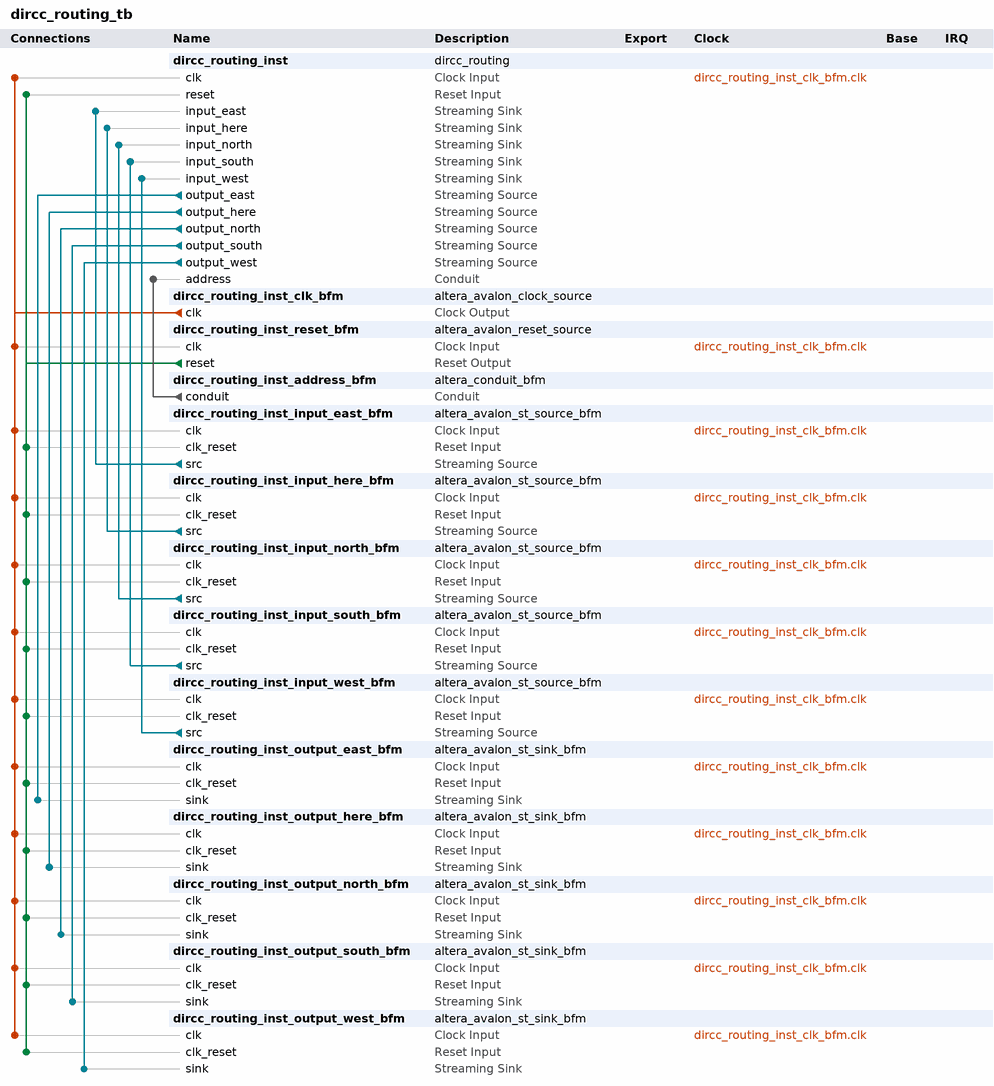
[diagram p0: system contents]
# Platform Designer (Qsys) system dircc_routing_tb, Cyclone V 5CSEMA5F31C6
# Parameters at their usual value, and those the tool derives, are not listed.
package require -exact qsys 16.1
create_system dircc_routing_tb
set_project_property DEVICE_FAMILY {Cyclone V}
set_project_property DEVICE 5CSEMA5F31C6

add_instance dircc_routing_inst dircc_routing 1.0

add_instance dircc_routing_inst_clk_bfm altera_avalon_clock_source 16.1

add_instance dircc_routing_inst_reset_bfm altera_avalon_reset_source 16.1
set_instance_parameter_value dircc_routing_inst_reset_bfm ASSERT_HIGH_RESET 0
set_instance_parameter_value dircc_routing_inst_reset_bfm INITIAL_RESET_CYCLES 50

add_instance dircc_routing_inst_address_bfm altera_conduit_bfm 16.1
set_instance_parameter_value dircc_routing_inst_address_bfm CLOCKED_SIGNAL false
set_instance_parameter_value dircc_routing_inst_address_bfm ENABLE_RESET false
set_instance_parameter_value dircc_routing_inst_address_bfm SIGNAL_DIRECTIONS output
set_instance_parameter_value dircc_routing_inst_address_bfm SIGNAL_ROLES address
set_instance_parameter_value dircc_routing_inst_address_bfm SIGNAL_WIDTHS 32

add_instance dircc_routing_inst_input_east_bfm altera_avalon_st_source_bfm 16.1
set_instance_parameter_value dircc_routing_inst_input_east_bfm ST_CHANNEL_W 1
set_instance_parameter_value dircc_routing_inst_input_east_bfm ST_ERROR_W 1
set_instance_parameter_value dircc_routing_inst_input_east_bfm ST_MAX_CHANNELS 0
set_instance_parameter_value dircc_routing_inst_input_east_bfm ST_NUMSYMBOLS 4
set_instance_parameter_value dircc_routing_inst_input_east_bfm ST_SYMBOL_W 8
set_instance_parameter_value dircc_routing_inst_input_east_bfm USE_CHANNEL 0
set_instance_parameter_value dircc_routing_inst_input_east_bfm USE_EMPTY 1
set_instance_parameter_value dircc_routing_inst_input_east_bfm USE_ERROR 0
set_instance_parameter_value dircc_routing_inst_input_east_bfm USE_PACKET 1
set_instance_parameter_value dircc_routing_inst_input_east_bfm USE_READY 1
set_instance_parameter_value dircc_routing_inst_input_east_bfm USE_VALID 1

add_instance dircc_routing_inst_input_here_bfm altera_avalon_st_source_bfm 16.1
set_instance_parameter_value dircc_routing_inst_input_here_bfm ST_CHANNEL_W 1
set_instance_parameter_value dircc_routing_inst_input_here_bfm ST_ERROR_W 1
set_instance_parameter_value dircc_routing_inst_input_here_bfm ST_MAX_CHANNELS 0
set_instance_parameter_value dircc_routing_inst_input_here_bfm ST_NUMSYMBOLS 4
set_instance_parameter_value dircc_routing_inst_input_here_bfm ST_SYMBOL_W 8
set_instance_parameter_value dircc_routing_inst_input_here_bfm USE_CHANNEL 0
set_instance_parameter_value dircc_routing_inst_input_here_bfm USE_EMPTY 1
set_instance_parameter_value dircc_routing_inst_input_here_bfm USE_ERROR 0
set_instance_parameter_value dircc_routing_inst_input_here_bfm USE_PACKET 1
set_instance_parameter_value dircc_routing_inst_input_here_bfm USE_READY 1
set_instance_parameter_value dircc_routing_inst_input_here_bfm USE_VALID 1
set_instance_parameter_value dircc_routing_inst_input_here_bfm VHDL_ID 1

add_instance dircc_routing_inst_input_north_bfm altera_avalon_st_source_bfm 16.1
set_instance_parameter_value dircc_routing_inst_input_north_bfm ST_CHANNEL_W 1
set_instance_parameter_value dircc_routing_inst_input_north_bfm ST_ERROR_W 1
set_instance_parameter_value dircc_routing_inst_input_north_bfm ST_MAX_CHANNELS 0
set_instance_parameter_value dircc_routing_inst_input_north_bfm ST_NUMSYMBOLS 4
set_instance_parameter_value dircc_routing_inst_input_north_bfm ST_SYMBOL_W 8
set_instance_parameter_value dircc_routing_inst_input_north_bfm USE_CHANNEL 0
set_instance_parameter_value dircc_routing_inst_input_north_bfm USE_EMPTY 1
set_instance_parameter_value dircc_routing_inst_input_north_bfm USE_ERROR 0
set_instance_parameter_value dircc_routing_inst_input_north_bfm USE_PACKET 1
set_instance_parameter_value dircc_routing_inst_input_north_bfm USE_READY 1
set_instance_parameter_value dircc_routing_inst_input_north_bfm USE_VALID 1
set_instance_parameter_value dircc_routing_inst_input_north_bfm VHDL_ID 2

add_instance dircc_routing_inst_input_south_bfm altera_avalon_st_source_bfm 16.1
set_instance_parameter_value dircc_routing_inst_input_south_bfm ST_CHANNEL_W 1
set_instance_parameter_value dircc_routing_inst_input_south_bfm ST_ERROR_W 1
set_instance_parameter_value dircc_routing_inst_input_south_bfm ST_MAX_CHANNELS 0
set_instance_parameter_value dircc_routing_inst_input_south_bfm ST_NUMSYMBOLS 4
set_instance_parameter_value dircc_routing_inst_input_south_bfm ST_SYMBOL_W 8
set_instance_parameter_value dircc_routing_inst_input_south_bfm USE_CHANNEL 0
set_instance_parameter_value dircc_routing_inst_input_south_bfm USE_EMPTY 1
set_instance_parameter_value dircc_routing_inst_input_south_bfm USE_ERROR 0
set_instance_parameter_value dircc_routing_inst_input_south_bfm USE_PACKET 1
set_instance_parameter_value dircc_routing_inst_input_south_bfm USE_READY 1
set_instance_parameter_value dircc_routing_inst_input_south_bfm USE_VALID 1
set_instance_parameter_value dircc_routing_inst_input_south_bfm VHDL_ID 3

add_instance dircc_routing_inst_input_west_bfm altera_avalon_st_source_bfm 16.1
set_instance_parameter_value dircc_routing_inst_input_west_bfm ST_CHANNEL_W 1
set_instance_parameter_value dircc_routing_inst_input_west_bfm ST_ERROR_W 1
set_instance_parameter_value dircc_routing_inst_input_west_bfm ST_MAX_CHANNELS 0
set_instance_parameter_value dircc_routing_inst_input_west_bfm ST_NUMSYMBOLS 4
set_instance_parameter_value dircc_routing_inst_input_west_bfm ST_SYMBOL_W 8
set_instance_parameter_value dircc_routing_inst_input_west_bfm USE_CHANNEL 0
set_instance_parameter_value dircc_routing_inst_input_west_bfm USE_EMPTY 1
set_instance_parameter_value dircc_routing_inst_input_west_bfm USE_ERROR 0
set_instance_parameter_value dircc_routing_inst_input_west_bfm USE_PACKET 1
set_instance_parameter_value dircc_routing_inst_input_west_bfm USE_READY 1
set_instance_parameter_value dircc_routing_inst_input_west_bfm USE_VALID 1
set_instance_parameter_value dircc_routing_inst_input_west_bfm VHDL_ID 4

add_instance dircc_routing_inst_output_east_bfm altera_avalon_st_sink_bfm 16.1
set_instance_parameter_value dircc_routing_inst_output_east_bfm ST_CHANNEL_W 1
set_instance_parameter_value dircc_routing_inst_output_east_bfm ST_ERROR_W 1
set_instance_parameter_value dircc_routing_inst_output_east_bfm ST_MAX_CHANNELS 0
set_instance_parameter_value dircc_routing_inst_output_east_bfm ST_NUMSYMBOLS 4
set_instance_parameter_value dircc_routing_inst_output_east_bfm ST_READY_LATENCY 0
set_instance_parameter_value dircc_routing_inst_output_east_bfm ST_SYMBOL_W 8
set_instance_parameter_value dircc_routing_inst_output_east_bfm USE_CHANNEL 0
set_instance_parameter_value dircc_routing_inst_output_east_bfm USE_EMPTY 1
set_instance_parameter_value dircc_routing_inst_output_east_bfm USE_ERROR 0
set_instance_parameter_value dircc_routing_inst_output_east_bfm USE_PACKET 1
set_instance_parameter_value dircc_routing_inst_output_east_bfm USE_READY 1
set_instance_parameter_value dircc_routing_inst_output_east_bfm USE_VALID 1
set_instance_parameter_value dircc_routing_inst_output_east_bfm VHDL_ID 0

add_instance dircc_routing_inst_output_here_bfm altera_avalon_st_sink_bfm 16.1
set_instance_parameter_value dircc_routing_inst_output_here_bfm ST_CHANNEL_W 1
set_instance_parameter_value dircc_routing_inst_output_here_bfm ST_ERROR_W 1
set_instance_parameter_value dircc_routing_inst_output_here_bfm ST_MAX_CHANNELS 0
set_instance_parameter_value dircc_routing_inst_output_here_bfm ST_NUMSYMBOLS 4
set_instance_parameter_value dircc_routing_inst_output_here_bfm ST_READY_LATENCY 0
set_instance_parameter_value dircc_routing_inst_output_here_bfm ST_SYMBOL_W 8
set_instance_parameter_value dircc_routing_inst_output_here_bfm USE_CHANNEL 0
set_instance_parameter_value dircc_routing_inst_output_here_bfm USE_EMPTY 1
set_instance_parameter_value dircc_routing_inst_output_here_bfm USE_ERROR 0
set_instance_parameter_value dircc_routing_inst_output_here_bfm USE_PACKET 1
set_instance_parameter_value dircc_routing_inst_output_here_bfm USE_READY 1
set_instance_parameter_value dircc_routing_inst_output_here_bfm USE_VALID 1
set_instance_parameter_value dircc_routing_inst_output_here_bfm VHDL_ID 1

add_instance dircc_routing_inst_output_north_bfm altera_avalon_st_sink_bfm 16.1
set_instance_parameter_value dircc_routing_inst_output_north_bfm ST_CHANNEL_W 1
set_instance_parameter_value dircc_routing_inst_output_north_bfm ST_ERROR_W 1
set_instance_parameter_value dircc_routing_inst_output_north_bfm ST_MAX_CHANNELS 0
set_instance_parameter_value dircc_routing_inst_output_north_bfm ST_NUMSYMBOLS 4
set_instance_parameter_value dircc_routing_inst_output_north_bfm ST_READY_LATENCY 0
set_instance_parameter_value dircc_routing_inst_output_north_bfm ST_SYMBOL_W 8
set_instance_parameter_value dircc_routing_inst_output_north_bfm USE_CHANNEL 0
set_instance_parameter_value dircc_routing_inst_output_north_bfm USE_EMPTY 1
set_instance_parameter_value dircc_routing_inst_output_north_bfm USE_ERROR 0
set_instance_parameter_value dircc_routing_inst_output_north_bfm USE_PACKET 1
set_instance_parameter_value dircc_routing_inst_output_north_bfm USE_READY 1
set_instance_parameter_value dircc_routing_inst_output_north_bfm USE_VALID 1
set_instance_parameter_value dircc_routing_inst_output_north_bfm VHDL_ID 2

add_instance dircc_routing_inst_output_south_bfm altera_avalon_st_sink_bfm 16.1
set_instance_parameter_value dircc_routing_inst_output_south_bfm ST_CHANNEL_W 1
set_instance_parameter_value dircc_routing_inst_output_south_bfm ST_ERROR_W 1
set_instance_parameter_value dircc_routing_inst_output_south_bfm ST_MAX_CHANNELS 0
set_instance_parameter_value dircc_routing_inst_output_south_bfm ST_NUMSYMBOLS 4
set_instance_parameter_value dircc_routing_inst_output_south_bfm ST_READY_LATENCY 0
set_instance_parameter_value dircc_routing_inst_output_south_bfm ST_SYMBOL_W 8
set_instance_parameter_value dircc_routing_inst_output_south_bfm USE_CHANNEL 0
set_instance_parameter_value dircc_routing_inst_output_south_bfm USE_EMPTY 1
set_instance_parameter_value dircc_routing_inst_output_south_bfm USE_ERROR 0
set_instance_parameter_value dircc_routing_inst_output_south_bfm USE_PACKET 1
set_instance_parameter_value dircc_routing_inst_output_south_bfm USE_READY 1
set_instance_parameter_value dircc_routing_inst_output_south_bfm USE_VALID 1
set_instance_parameter_value dircc_routing_inst_output_south_bfm VHDL_ID 3

add_instance dircc_routing_inst_output_west_bfm altera_avalon_st_sink_bfm 16.1
set_instance_parameter_value dircc_routing_inst_output_west_bfm ST_CHANNEL_W 1
set_instance_parameter_value dircc_routing_inst_output_west_bfm ST_ERROR_W 1
set_instance_parameter_value dircc_routing_inst_output_west_bfm ST_MAX_CHANNELS 0
set_instance_parameter_value dircc_routing_inst_output_west_bfm ST_NUMSYMBOLS 4
set_instance_parameter_value dircc_routing_inst_output_west_bfm ST_READY_LATENCY 0
set_instance_parameter_value dircc_routing_inst_output_west_bfm ST_SYMBOL_W 8
set_instance_parameter_value dircc_routing_inst_output_west_bfm USE_CHANNEL 0
set_instance_parameter_value dircc_routing_inst_output_west_bfm USE_EMPTY 1
set_instance_parameter_value dircc_routing_inst_output_west_bfm USE_ERROR 0
set_instance_parameter_value dircc_routing_inst_output_west_bfm USE_PACKET 1
set_instance_parameter_value dircc_routing_inst_output_west_bfm USE_READY 1
set_instance_parameter_value dircc_routing_inst_output_west_bfm USE_VALID 1
set_instance_parameter_value dircc_routing_inst_output_west_bfm VHDL_ID 4

# connections
add_connection dircc_routing_inst_clk_bfm.clk dircc_routing_inst.clk clock
add_connection dircc_routing_inst_clk_bfm.clk dircc_routing_inst_input_east_bfm.clk clock
add_connection dircc_routing_inst_clk_bfm.clk dircc_routing_inst_input_here_bfm.clk clock
add_connection dircc_routing_inst_clk_bfm.clk dircc_routing_inst_input_north_bfm.clk clock
add_connection dircc_routing_inst_clk_bfm.clk dircc_routing_inst_input_south_bfm.clk clock
add_connection dircc_routing_inst_clk_bfm.clk dircc_routing_inst_input_west_bfm.clk clock
add_connection dircc_routing_inst_clk_bfm.clk dircc_routing_inst_output_east_bfm.clk clock
add_connection dircc_routing_inst_clk_bfm.clk dircc_routing_inst_output_here_bfm.clk clock
add_connection dircc_routing_inst_clk_bfm.clk dircc_routing_inst_output_north_bfm.clk clock
add_connection dircc_routing_inst_clk_bfm.clk dircc_routing_inst_output_south_bfm.clk clock
add_connection dircc_routing_inst_clk_bfm.clk dircc_routing_inst_output_west_bfm.clk clock
add_connection dircc_routing_inst_clk_bfm.clk dircc_routing_inst_reset_bfm.clk clock
add_connection dircc_routing_inst_reset_bfm.reset dircc_routing_inst.reset reset
add_connection dircc_routing_inst_reset_bfm.reset dircc_routing_inst_input_east_bfm.clk_reset reset
add_connection dircc_routing_inst_reset_bfm.reset dircc_routing_inst_input_here_bfm.clk_reset reset
add_connection dircc_routing_inst_reset_bfm.reset dircc_routing_inst_input_north_bfm.clk_reset reset
add_connection dircc_routing_inst_reset_bfm.reset dircc_routing_inst_input_south_bfm.clk_reset reset
add_connection dircc_routing_inst_reset_bfm.reset dircc_routing_inst_input_west_bfm.clk_reset reset
add_connection dircc_routing_inst_reset_bfm.reset dircc_routing_inst_output_east_bfm.clk_reset reset
add_connection dircc_routing_inst_reset_bfm.reset dircc_routing_inst_output_here_bfm.clk_reset reset
add_connection dircc_routing_inst_reset_bfm.reset dircc_routing_inst_output_north_bfm.clk_reset reset
add_connection dircc_routing_inst_reset_bfm.reset dircc_routing_inst_output_south_bfm.clk_reset reset
add_connection dircc_routing_inst_reset_bfm.reset dircc_routing_inst_output_west_bfm.clk_reset reset
add_connection dircc_routing_inst.output_east dircc_routing_inst_output_east_bfm.sink avalon_streaming
add_connection dircc_routing_inst.output_here dircc_routing_inst_output_here_bfm.sink avalon_streaming
add_connection dircc_routing_inst.output_north dircc_routing_inst_output_north_bfm.sink avalon_streaming
add_connection dircc_routing_inst.output_south dircc_routing_inst_output_south_bfm.sink avalon_streaming
add_connection dircc_routing_inst.output_west dircc_routing_inst_output_west_bfm.sink avalon_streaming
add_connection dircc_routing_inst_input_east_bfm.src dircc_routing_inst.input_east avalon_streaming
add_connection dircc_routing_inst_input_here_bfm.src dircc_routing_inst.input_here avalon_streaming
add_connection dircc_routing_inst_input_north_bfm.src dircc_routing_inst.input_north avalon_streaming
add_connection dircc_routing_inst_input_south_bfm.src dircc_routing_inst.input_south avalon_streaming
add_connection dircc_routing_inst_input_west_bfm.src dircc_routing_inst.input_west avalon_streaming
add_connection dircc_routing_inst_address_bfm.conduit dircc_routing_inst.address conduit

set_interconnect_requirement {$system} qsys_mm.clockCrossingAdapter HANDSHAKE
set_interconnect_requirement {$system} qsys_mm.enableEccProtection FALSE
set_interconnect_requirement {$system} qsys_mm.insertDefaultSlave FALSE
set_interconnect_requirement {$system} qsys_mm.maxAdditionalLatency 1

save_system dircc_routing_tb.qsys
